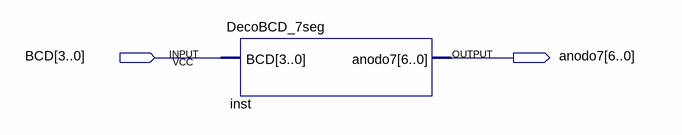
[diagram p0: schematic sheet]
// Quartus schematic bloqueDecodificadorBCDa7seg.bdf as structural Verilog: 1 symbols, 2 pins
module bloqueDecodificadorBCDa7seg (
  input  [3:0] BCD,
  output [6:0] anodo7
);

  DecoBCD_7seg inst (.BCD(BCD), .anodo7(anodo7));
endmodule
